# EAGLE design secondary (EAGLE 6.5.0)
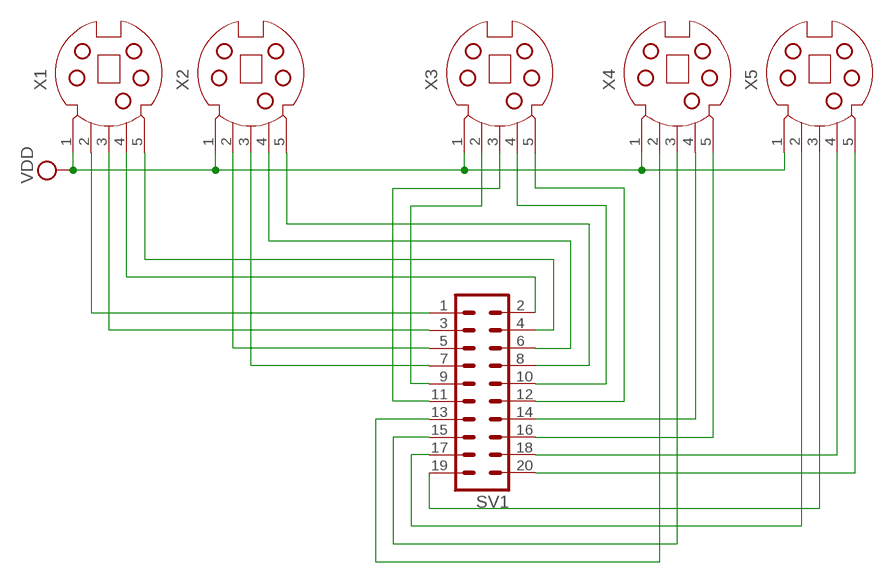
[diagram p0: schematic, sheet 1]

## Parts
SV1  MA10-2  [MA10-2]
X1  MD05S  [MDIN05S]
X2  MD05S  [MDIN05S]
X3  MD05S  [MDIN05S]
X4  MD05S  [MDIN05S]
X5  MD05S  [MDIN05S]

## Nets
N$1: SV1.1 X1.2
N$2: SV1.2 X1.4
N$3: SV1.3 X1.3
N$4: SV1.4 X1.5
N$5: SV1.5 X2.2
N$6: SV1.6 X2.4
N$7: SV1.7 X2.3
N$8: SV1.8 X2.5
N$9: SV1.9 X3.2
N$10: SV1.10 X3.4
N$11: SV1.11 X3.3
N$12: SV1.12 X3.5
N$13: SV1.14 X4.4
N$14: SV1.16 X4.5
N$15: SV1.18 X5.4
N$16: SV1.20 X5.5
N$17: SV1.19 X5.3
N$18: SV1.17 X5.2
N$19: SV1.15 X4.3
N$20: SV1.13 X4.2
VDD: X1.1 X2.1 X3.1 X4.1 X5.1

## Library data of the parts
SV1 = con-lstb:MA10-2: PIN HEADER; OC_FARNELL: unknown; OC_NEWARK: unknown
X1-X5 = con-yamaichi:MD05S: YAMAICHI CONNECTOR; OC_FARNELL: unknown; OC_NEWARK: unknown

## Board
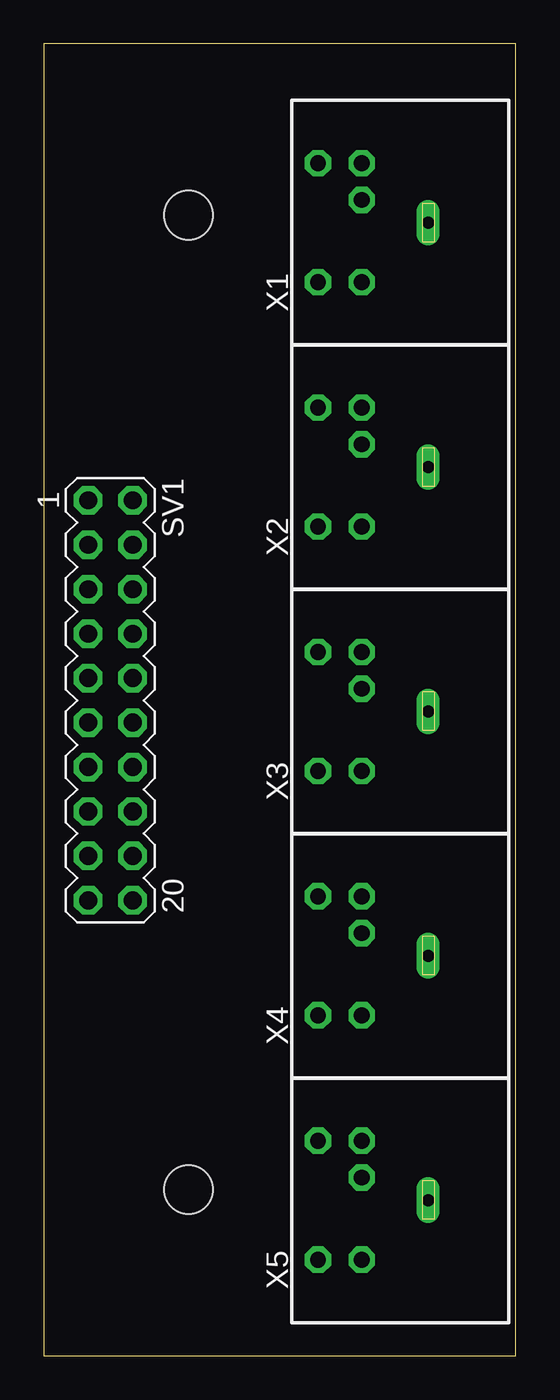
[diagram p1: board, top side]
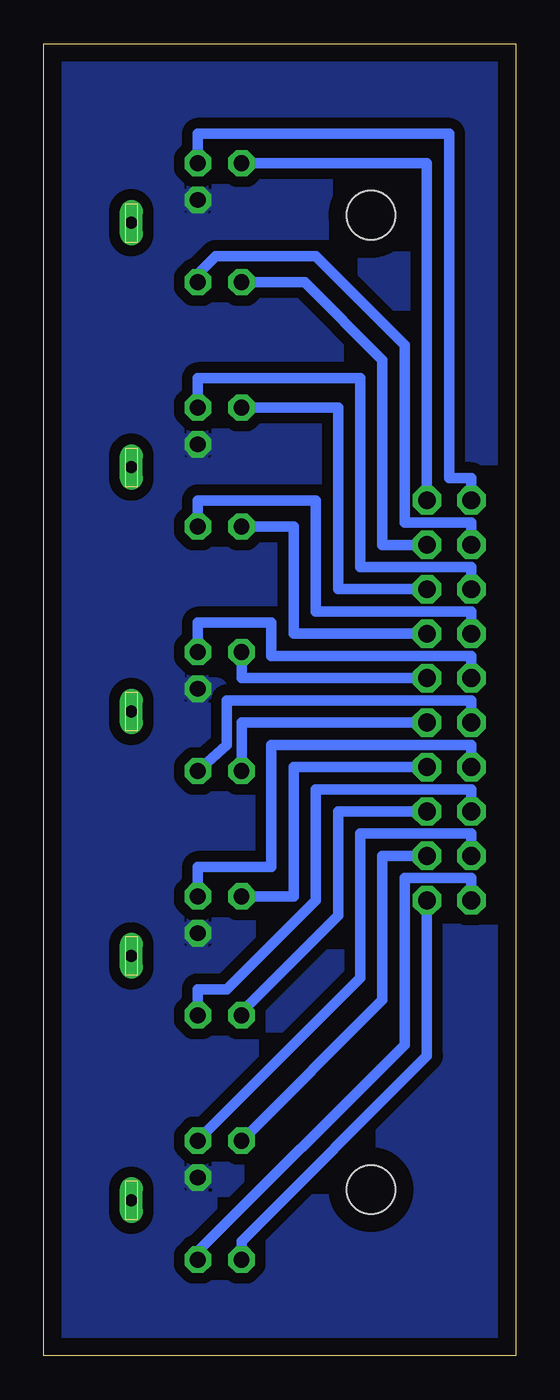
[diagram p2: board, bottom side, seen from below]

Size 26.98 x 75 mm. Coordinates in mm from the lower left corner, seen from the top.
Outline: 0,0 26.98,0 26.98,75 0,75 0,0
Copper layers (1*16): Top 0.035mm / dielectric 1.5mm / Bottom 0.035mm
Design rules "default *": minimum track width 10mil, minimum drill 24mil, track to track 8mil, track to pad 8mil, pad to pad 8mil, via to via 8mil, smd to smd 8mil, copper to edge 40mil, drill to drill 8mil, minimum pad ring 12mil, minimum via ring 8mil, stop-mask expansion 4mil, vias tented up to drill 0mil, thermal gap 10mil
Holes 2.8 mm at 8.28,9.5 8.28,65.2

### Footprints (pad centres in the part's own frame; a part is rotated, then mirrored left to right if it is on the bottom)
MA10-2 = drill 1.016 octagon: 1 -11.43,-1.27; 2 -11.43,1.27; 3 -8.89,-1.27; 4 -8.89,1.27; 5 -6.35,-1.27; 6 -6.35,1.27; 7 -3.81,-1.27; 8 -3.81,1.27; 9 -1.27,-1.27; 10 -1.27,1.27; 11 1.27,-1.27; 12 1.27,1.27; 13 3.81,-1.27; 14 3.81,1.27; 15 6.35,-1.27; 16 6.35,1.27; 17 8.89,-1.27; 18 8.89,1.27; 19 11.43,-1.27; 20 11.43,1.27
MDIN05S = drill 0.9 octagon: 1 1.3,8.5; 2 3.4,8.5; 3 -3.4,8.5; 4 3.4,11; 5 -3.4,11 | drill 0.7 long: M 0,4.7

### Placement (x,y rotation side)
SV1  3.81,37.47 270 top
X1  26.67,64.77 90 top
X2  26.67,50.8 90 top
X3  26.67,36.83 90 top
X4  26.67,22.86 90 top
X5  26.67,8.89 90 top

### Tracks (layer width: path | path; a pad name or v marks a point on that pad's centre or on a via)
N$1
  Bottom 0.61: SV1.1 2.54,50.16 3.81,50.16 3.81,69.85 18.17,69.85 X1.2
N$2
  Bottom 0.61: SV1.2 5.08,68.17 X1.4
N$3
  Bottom 0.61: SV1.3 2.54,47.62 6.35,47.62 6.35,57.78 11.43,62.87 17.14,62.87 18.17,61.84 X1.3
N$4
  Bottom 0.61: SV1.4 7.62,46.35 7.62,56.92 12.06,61.37 X1.5
N$5
  Bottom 0.61: SV1.5 2.54,45.09 8.89,45.09 8.89,55.88 18.17,55.88 X2.2
N$6
  Bottom 0.61: SV1.6 10.16,43.81 10.16,54.2 X2.4
N$7
  Bottom 0.61: SV1.7 2.54,42.55 11.43,42.55 11.43,48.9 18.17,48.9 X2.3
N$8
  Bottom 0.61: SV1.8 12.7,41.27 12.7,47.4 X2.5
N$9
  Bottom 0.61: SV1.9 2.54,40.01 13.97,40.01 13.97,41.91 18.17,41.91 X3.2
N$10
  Bottom 0.61: SV1.10 15.67,38.73 X3.4
N$11
  Bottom 0.61: SV1.11 2.54,37.47 16.51,37.47 16.51,34.92 X3.3
N$12
  Bottom 0.61: SV1.12 15.67,36.2 X3.5
N$13
  Bottom 0.61: SV1.14 12.7,33.66 12.7,26.26 X4.4
N$14
  Bottom 0.61: SV1.16 10.16,31.11 10.16,25.18 15.67,19.66 X4.5
N$15
  Bottom 0.61: SV1.18 7.62,28.57 7.62,20.34 X5.4
N$16
  Bottom 0.61: SV1.20 5.08,17.14 15.67,6.55 X5.5
N$17
  Bottom 0.61: SV1.19 2.54,27.3 6.35,27.3 6.35,17.78 18.17,5.96 X5.3
N$18
  Bottom 0.61: SV1.17 2.54,29.84 8.89,29.84 8.89,21.59 18.17,12.31 X5.2
N$19
  Bottom 0.61: SV1.15 2.54,32.38 11.43,32.38 11.43,26.04 16.51,20.95 18.17,20.95 X4.3
N$20
  Bottom 0.61: SV1.13 2.54,34.92 13.97,34.92 13.97,27.94 18.17,27.94 X4.2
VDD
  pour Bottom (isolate 0.61): 1.27,73.66 26.04,73.66 26.04,1.27 1.27,1.27